# EAGLE design dd2007 (EAGLE 5.00)

## Sheet 1 of 2
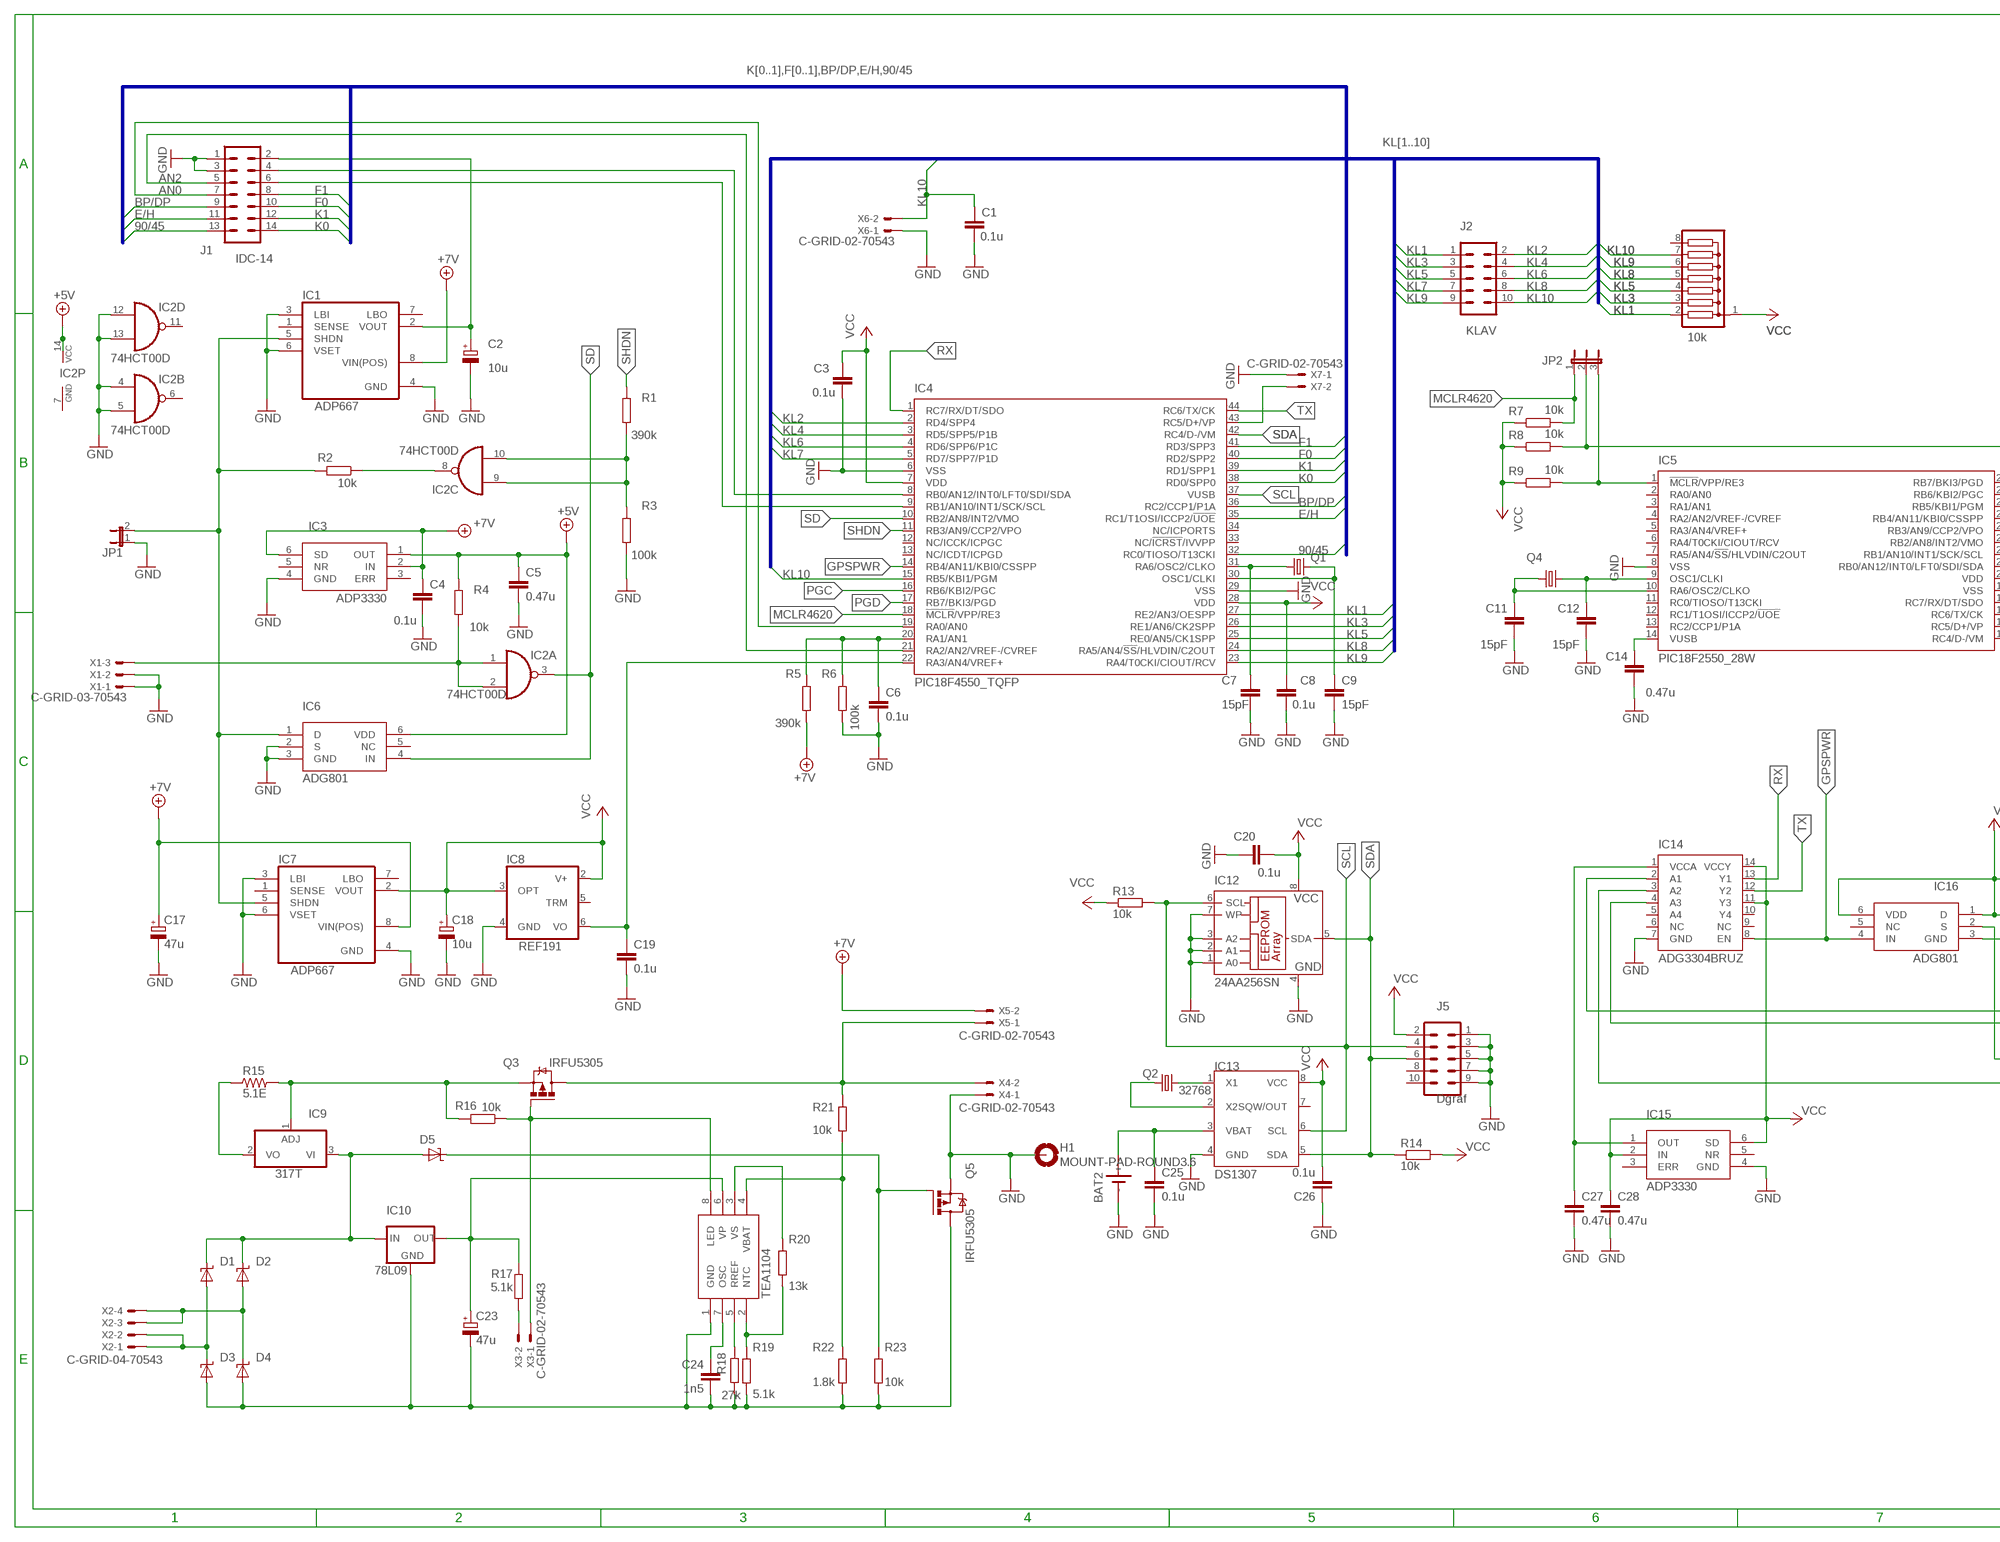
[diagram p0: schematic, sheet 1, part 1 of 2]
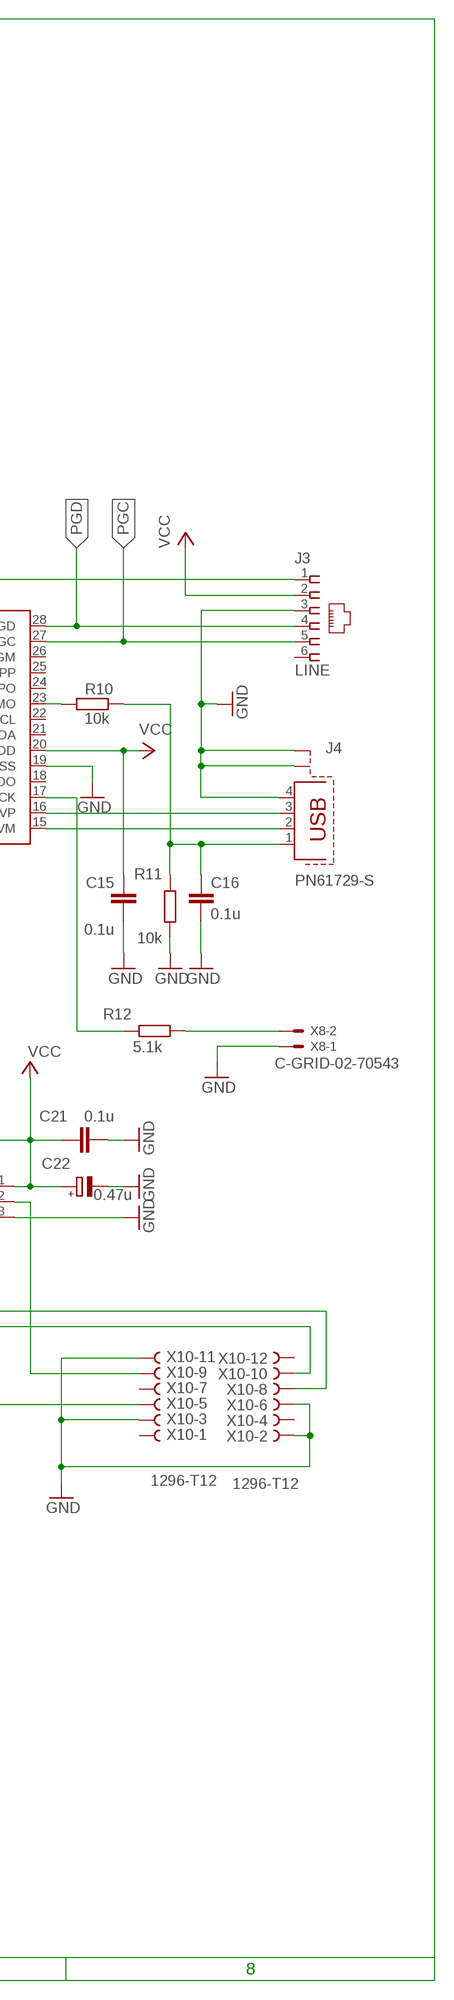
[diagram p1: schematic, sheet 1, part 2 of 2]

### Parts
BAT2  SN2032  [SN2032]
C1  0.1u  C-EUC1206  [C1206]
C2  10u  CPOL-EUCT3528  [CT3528]
C3  0.1u  C-EUC1206  [C1206]
C4  0.1u  C-EUC1206  [C1206]
C5  0.47u  C-EUC1206  [C1206]
C6  0.1u  C-EUC1206  [C1206]
C7  15pF  C-EUC1206  [C1206]
C8  0.1u  C-EUC1206  [C1206]
C9  15pF  C-EUC1206  [C1206]
C11  15pF  C-EUC1206  [C1206]
C12  15pF  C-EUC1206  [C1206]
C14  0.47u  C-EUC1206  [C1206]
C15  0.1u  C-EUC1206  [C1206]
C16  0.1u  C-EUC1206  [C1206]
C17  47u  CPOL-EUCT3528  [CT3528]
C18  10u  CPOL-EUCT3528  [CT3528]
C19  0.1u  C-EUC1206  [C1206]
C20  0.1u  C-EUC1206  [C1206]
C21  0.1u  C-EUC1206  [C1206]
C22  0.47u  CPOL-EUCT3528  [CT3528]
C23  47u  CPOL-EUCT3528  [CT3528]
C24  1n5  C-EUC1206  [C1206]
C25  0.1u  C-EUC1206  [C1206]
C26  0.1u  C-EUC1206  [C1206]
C27  0.47u  C-EUC1206  [C1206]
C28  0.47u  C-EUC1206  [C1206]
D1  SUPPRESSOR-SMBJ  [SMBJ]
D2  SUPPRESSOR-SMBJ  [SMBJ]
D3  SUPPRESSOR-SMBJ  [SMBJ]
D4  SUPPRESSOR-SMBJ  [SMBJ]
D5  SUPPRESSOR-SMBJ  [SMBJ]
H1  MOUNT-PAD-ROUND3.6  [3,6-PAD]
IC1  ADP667  MAX666CSA  [SO08]
IC2  74HCT00D  [SO14]
IC3  ADP3330  [SOT-23-6]
IC4  PIC18F4550_TQFP  [TQFP44]
IC5  PIC18F2550_28W  [SO28W]
IC6  ADG801  [SOT-23-6]
IC7  ADP667  MAX666CSA  [SO08]
IC8  REF191  REF01D  [SO08]
IC9  317T  [TO220H]
IC10  78L09  78LXX  [78LXX]
IC11  TEA1104  [SOIC-8]
IC12  24AA256SN  [SO-08]
IC13  DS1307  [SOIC-8]
IC14  ADG3304BRUZ  [TSSOP14]
IC15  ADP3330  [SOT-23-6]
IC16  ADG801  [SOT-23-6]
J1  IDC-14  ML14  [ML14]
J2  KLAV  ML10  [ML10]
J3  LINE  520258-3  [520258-3]
J4  PN61729-S  [PN61729-S]
J5  Dgraf  ML10  [ML10]
JP1  JP1E  [JP1]
JP2  JP2E  [JP2]
Q1  CRYSTALHC49S  [HC49/S]
Q2  32768  CRYSTALTC38H  [TC38H]
Q3  IRFU5305  [I-PAK_TO251AA]
Q4  CRYSTALHC49S  [HC49/S]
Q5  IRFU5305  [I-PAK_TO251AA]
R1  390k  R-EU_M1206  [M1206]
R2  10k  R-EU_M1206  [M1206]
R3  100k  R-EU_M1206  [M1206]
R4  10k  R-EU_M1206  [M1206]
R5  390k  R-EU_M1206  [M1206]
R6  100k  R-EU_M1206  [M1206]
R7  10k  R-EU_M1206  [M1206]
R8  10k  R-EU_M1206  [M1206]
R9  10k  R-EU_M1206  [M1206]
R10  10k  R-EU_M1206  [M1206]
R11  10k  R-EU_M1206  [M1206]
R12  5.1k  R-EU_M1206  [M1206]
R13  10k  R-EU_M1206  [M1206]
R14  10k  R-EU_M1206  [M1206]
R15  5.1E  R_X0207/10B  [0207/10B]
R16  10k  R-EU_M1206  [M1206]
R17  5.1k  R-EU_M1206  [M1206]
R18  27k  R-EU_M1206  [M1206]
R19  5.1k  R-EU_M1206  [M1206]
R20  13k  R-EU_M1206  [M1206]
R21  10k  R-EU_M1206  [M1206]
R22  1.8k  R-EU_M1206  [M1206]
R23  10k  R-EU_M1206  [M1206]
RN1  10k  G07R  [SIL8]
X1  C-GRID-03-70543  [70543-03]
X2  C-GRID-04-70543  [70543-04]
X3  C-GRID-02-70543  [70543-02]
X4  C-GRID-02-70543  [70543-02]
X5  C-GRID-02-70543  [70543-02]
X6  C-GRID-02-70543  [70543-02]
X7  C-GRID-02-70543  [70543-02]
X8  C-GRID-02-70543  [70543-02]
X10  1296-T12  [1296-12]

### Nets
90/45 [net12]: IC4.32(RC0/TIOSO/T13CKI) J1.13
+5V [net12]: C5.1 IC2.14(P:VCC) IC3.1(OUT) IC6.6(VDD) R4.2
+7V [power25]: C4.1 C17.+ IC1.8(VIN(POS)) IC3.2(IN) IC3.6(SD) IC7.8(VIN(POS)) R5.1 X5.2
AN0 [net12]: IC4.19(RA0/AN0) J1.7
AN2 [net12]: IC4.21(RA2/AN2/VREF-/CVREF) J1.5
BP/DP [net12]: IC4.36(RC2/CCP1/P1A) J1.9
E/H [net12]: IC4.35(RC1/T1OSI/ICCP2/!UOE) J1.11
F0 [net12]: IC4.40(RD2/SPP2) J1.10
F1 [net12]: IC4.41(RD3/SPP3) J1.8
GND [net12]: BAT2.P$2(-) C1.1 C2.- C3.1 C4.2 C5.2 C6.2 C7.2 C8.1 C9.2 C11.1 C12.1 C14.1 C15.1 C16.2 C17.- C18.- C19.2 C20.2 C21.2 C22.- C25.2 C26.1 C27.2 C28.2 H1.B3,6(MOUNT) IC1.3(LBI) IC1.4(GND) IC1.6(VSET) IC2.4(B:I0) IC2.5(B:I1) IC2.12(D:I0) IC2.13(D:I1) IC3.4(GND) IC4.6(VSS) IC4.29(VSS) IC5.8(VSS) IC5.19(VSS) IC6.2(S) IC6.3(GND) IC7.3(LBI) IC7.4(GND) IC7.6(VSET) IC8.4(GND) IC12.1(A0) IC12.2(A1) IC12.3(A2) IC12.4(GND) IC12.7(WP) IC13.4(GND) IC14.7(GND) IC15.4(GND) IC16.3(GND) J1.1 J1.3 J3.3 J4.4 J4.S1 J4.S2 J5.1 J5.3 J5.5 J5.7 J5.9 JP1.1 Q5.3(S) R3.1 R6.1 R11.1 X1.1 X1.2 X4.1 X6.1 X7.1 X8.1 X10.2 X10.3 X10.6 X10.11
GPSPWR [net12]: IC4.14(RB4/AN11/KBI0/CSSPP) IC14.8(EN) IC16.4(IN)
K0 [net12]: IC4.38(RD0/SPP0) J1.14
K1 [net12]: IC4.39(RD1/SPP1) J1.12
KL1 [net12]: IC4.27(RE2/AN3/OESPP) J2.1 RN1.2
KL2 [net12]: IC4.2(RD4/SPP4) J2.2
KL3 [net12]: IC4.26(RE1/AN6/CK2SPP) J2.3 RN1.3
KL4 [net12]: IC4.3(RD5/SPP5/P1B) J2.4
KL5 [net12]: IC4.25(RE0/AN5/CK1SPP) J2.5 RN1.4
KL6 [net12]: IC4.4(RD6/SPP6/P1C) J2.6
KL7 [net12]: IC4.5(RD7/SPP7/P1D) J2.7
KL8 [net12]: IC4.24(RA5/AN4/!SS!/HLVDIN/C2OUT) J2.8 RN1.5
KL9 [net12]: IC4.23(RA4/T0CKI/CIOUT/RCV) J2.9 RN1.6
KL10 [net12]: C1.2 IC4.15(RB5/KBI1/PGM) J2.10 RN1.7 X6.2
MCLR4620 [net12]: IC4.18(!MCLR!/VPP/RE3) JP2.1 R7.2
N$1 [power]: D2.A D4.C X2.3 X2.4
N$2 [power]: D1.A D3.C X2.1 X2.2
N$3 [power]: IC9.1(ADJ) Q3.3(S) R15.2 R16.2
N$4 [power]: IC9.2(VO) R15.1
N$5 [power]: D1.C D2.C D5.A IC9.3(VI) IC10.IN
N$6 [power]: C23.- C24.1 D3.A D4.A IC10.GND IC11.1(GND) Q5.2(D) R18.1 R19.2 R22.2 R23.2
N$7 [net16]: C23.+ IC10.OUT IC11.6(VP) R17.2
N$8 [net16]: R17.1 X3.2
N$9 [net12]: IC11.8(LED) Q3.1(G) R16.1 X3.1
N$10 [power25]: C2.+ IC1.2(VOUT) J1.2
N$11: IC2.8(C:O) R2.1
N$12 [net12]: IC1.5(SHDN) IC6.1(D) IC7.5(SHDN) JP1.2 R2.2
N$13 [net12]: C19.1 IC4.22(RA3/AN4/VREF+) IC8.6(VO)
N$14 [net12]: C7.1 IC4.31(RA6/OSC2/CLKO) Q1.1
N$15 [net12]: C24.2 IC11.7(OSC)
N$16 [net12]: IC11.5(RREF) R18.2
N$17 [net12]: IC13.1(X1) Q2.2
N$18 [net12]: IC13.2(X2) Q2.1
N$19: IC4.43(RC5/D+/VP) X7.2
N$20 [net12]: C9.1 IC4.30(OSC1/CLKI) Q1.2
N$21 [net12]: J3.1 JP2.2 R8.2
N$22 [net12]: IC11.2(NTC) R19.1 R20.2
N$23 [net12]: C12.2 IC5.9(OSC1/CLKI) Q4.2
N$24 [net12]: C11.2 IC5.10(RA6/OSC2/CLKO) Q4.1
N$25 [net12]: C14.2 IC5.14(VUSB)
N$26 [net12]: IC5.1(!MCLR!/VPP/RE3) JP2.3 R9.2
N$27 [net12]: D5.C Q5.1(G) R23.1
N$28 [net12]: IC2.1(A:I0) IC2.2(A:I1) R4.1 X1.3
N$30 [net12]: IC5.23(RB2/AN8/INT2/VMO) R10.1
N$31 [net12]: C16.1 J4.1 R10.2 R11.2
N$32 [net12]: IC5.15(RC4/D-/VM) J4.2
N$33 [net12]: IC5.16(RC5/D+/VP) J4.3
N$34 [net12]: IC5.17(RC6/TX/CK) R12.2
N$35 [net12]: R12.1 X8.2
N$37 [net12]: IC4.8(RB0/AN12/INT0/LFT0/SDI/SDA) J1.4
N$38 [net12]: C6.1 IC4.20(RA1/AN1) R5.2 R6.2
N$39 [net12]: IC4.9(RB1/AN10/INT1/SCK/SCL) J1.6
N$40 [net12]: IC11.3(VS) R20.1
N$41 [net12]: IC11.4(VBAT) R21.2 R22.1
N$42 [power]: Q3.2(D) R21.1 X4.2 X5.1
N$43 [net12]: IC2.9(C:I0) IC2.10(C:I1) R1.1 R3.2
N$44 [net12]: IC14.2(A1) X10.8
N$45 [net12]: IC16.2(S) X10.9
N$46 [net12]: IC14.3(A2) X10.5
N$47 [net12]: C27.1 IC14.1(VCCA) IC15.1(OUT)
N$48 [net12]: IC14.4(A3) X10.10
N$50 [net12]: BAT2.P$1(+) C25.1 IC13.3(VBAT)
PGC [net12]: IC4.16(RB6/KBI2/PGC) IC5.27(RB6/KBI2/PGC) J3.5
PGD [net12]: IC4.17(RB7/BKI3/PGD) IC5.28(RB7/BKI3/PGD) J3.4
RX [net12]: IC4.1(RC7/RX/DT/SDO) IC14.13(Y1)
SCL [net12]: IC4.37(VUSB) IC12.6(SCL) IC13.6(SCL) J5.4 R13.2
SD [net12]: IC2.3(A:O) IC4.10(RB2/AN8/INT2/VMO) IC6.4(IN)
SDA [net12]: IC4.42(RC4/D-/VM) IC12.5(SDA) IC13.5(SDA) J5.6 R14.1
SHDN [net12]: IC4.11(RB3/AN9/CCP2/VPO) R1.2
TX [net12]: IC4.44(RC6/TX/CK) IC14.12(Y2)
VCC [net12]: C3.2 C8.2 C15.2 C18.+ C20.1 C21.1 C22.+ C26.2 C28.1 IC4.7(VDD) IC4.28(VDD) IC5.20(VDD) IC7.2(VOUT) IC8.2(V+) IC8.3(OPT) IC12.8(VCC) IC13.8(VCC) IC14.11(Y3) IC14.14(VCCY) IC15.2(IN) IC15.6(SD) IC16.1(D) IC16.6(VDD) J3.2 J5.2 R7.1 R8.1 R9.1 R13.1 R14.2 RN1.1
Unconnected: IC1.1(SENSE) IC1.7(LBO) IC2.6(B:O) IC2.11(D:O) IC3.3(ERR) IC3.5(NR) IC4.12(NC/ICCK/ICPGC) IC4.13(NC/ICDT/ICPGD) IC4.33(NC/!ICRST!/IVVPP) IC4.34(NC/ICPORTS) IC5.2(RA0/AN0) IC5.3(RA1/AN1) IC5.4(RA2/AN2/VREF-/CVREF) IC5.5(RA3/AN4/VREF+) IC5.6(RA4/T0CKI/CIOUT/RCV) IC5.7(RA5/AN4/!SS!/HLVDIN/C2OUT) IC5.11(RC0/TIOSO/T13CKI) IC5.12(RC1/T1OSI/ICCP2/!UOE) IC5.13(RC2/CCP1/P1A) IC5.18(RC7/RX/DT/SDO) IC5.21(RB0/AN12/INT0/LFT0/SDI/SDA) IC5.22(RB1/AN10/INT1/SCK/SCL) IC5.24(RB3/AN9/CCP2/VPO) IC5.25(RB4/AN11/KBI0/CSSPP) IC5.26(RB5/KBI1/PGM) IC6.5(NC) IC7.1(SENSE) IC7.7(LBO) IC8.5(TRM) IC13.7(SQW/OUT) IC14.5(A4) IC14.6(NC) IC14.9(NC) IC14.10(Y4) IC15.3(ERR) IC15.5(NR) IC16.5(NC) J3.6 J5.8 J5.10 RN1.8 X10.1 X10.4 X10.7 X10.12

### Buses
KL[1..10]
K[0..1],F[0..1],BP/DP,E/H,90/45

## Sheet 2 of 2

## Power pins joined to a net without a drawn wire
GND: IC2.7(P:GND)

## Library data of the parts
BAT2 = sn2032:SN2032: LI BATTERY dip07
C1 C3-C9 C11 C12 C14-C16 C19-C21 C24-C28 = rcl:C-EU: CAPACITOR, European symbol
C2 C17 C18 C22 C23 = rcl:CPOL-EU: POLARIZED CAPACITOR, European symbol
D1-D5 = diode:SUPPRESSOR-: Suppressor diode
H1 = holes:MOUNT-PAD-ROUND: MOUNTING PAD, round
IC1 IC7 = maxim:MAX666CSA: Positive VOLTAGE REGULATOR
IC2 = 74xx-eu:74*00: Quad 2-input NAND gate
IC3 IC15 = raznoe01:ADP3330: adp3330
IC4 = microchip:PIC18F4*_TQFP: USB Microcontrollers with nanoWatt Technology High-Performance, Enhanced Flash, 28/40/44-Pin, Source: http://ww1.microchip.com/downloads/en/devicedoc/39632c.pdf
IC5 = microchip:PIC18F2*_28: USB Microcontrollers with nanoWatt Technology High-Performance, Enhanced Flash, 28/40/44-Pin, Source: http://ww1.microchip.com/downloads/en/devicedoc/39632c.pdf
IC6 IC16 = raznoe01:ADG801: adg801 adg 801 adg-801
IC8 = linear:REF01: VOLTAGE REFERENCE
IC9 = linear:*317: Positive VOLTAGE REGULATOR
IC10 = v-reg:78LXX: VOLTAGE REGULATOR
IC11 = raznoe01:TEA1104: tea1104
IC12 = microchip:24*: Serial EEPROM I2C
IC13 = dallas-1:DS1307: I2C Serial RTC w/56 bytes battery backed RAM
IC14 = ad74111_adg3304:ADG3304B?Z: Low Voltage, 1.15 V to 5.5 V, 4-Channel, Bidirectional Logic Level Translator Source: http://www.analog.com/UploadedFiles/Data_Sheets/642205373ADG3304_b.pdf
J1 = con-harting-ml:ML14: HARTING
J2 J5 = con-harting-ml:ML10: HARTING
J3 = con-amp:520258-3: AMP connector
J4 = con-berg:PN61729-S: BERG USB connector
JP1 = jumper:JP1E: JUMPER
JP2 = jumper:JP2E: JUMPER
Q1 Q2 Q4 = crystal:CRYSTAL: CRYSTAL
Q3 Q5 = transistor-power:IRF?5305: HEXFET Power MOSFET Source: http://www.irf.com/product-info/datasheets/data/irfr5305pbf.pdf
R1-R14 R16-R23 = rcl:R-EU_: RESISTOR, European symbol
R15 = rc-master:R_: RESISTOR
RN1 = resistor-sil:G07R: SIL RESISTOR
X1 = con-molex:C-GRID-03: CONNECTOR wire to board 2.54 mm (0.100") pitch header
X2 = con-molex:C-GRID-04: CONNECTOR wire to board 2.54 mm (0.100") pitch header
X3-X8 = con-molex:C-GRID-02: CONNECTOR wire to board 2.54 mm (0.100") pitch header
X10 = con-leotronics:1296-T12: 1.27mm SINGLE ROW FEMALE SOCKET Source: http://www.leotronics.co.uk/Conexcon/Data%20Sheets/sec.%20A/1296ing.pdf

## Net classes
1 power: width 0.813 mm
2 net12: width 0.305 mm
3 power25: width 0.635 mm
4 power24: width 0.61 mm
5 net16: width 0.406 mm

## Board
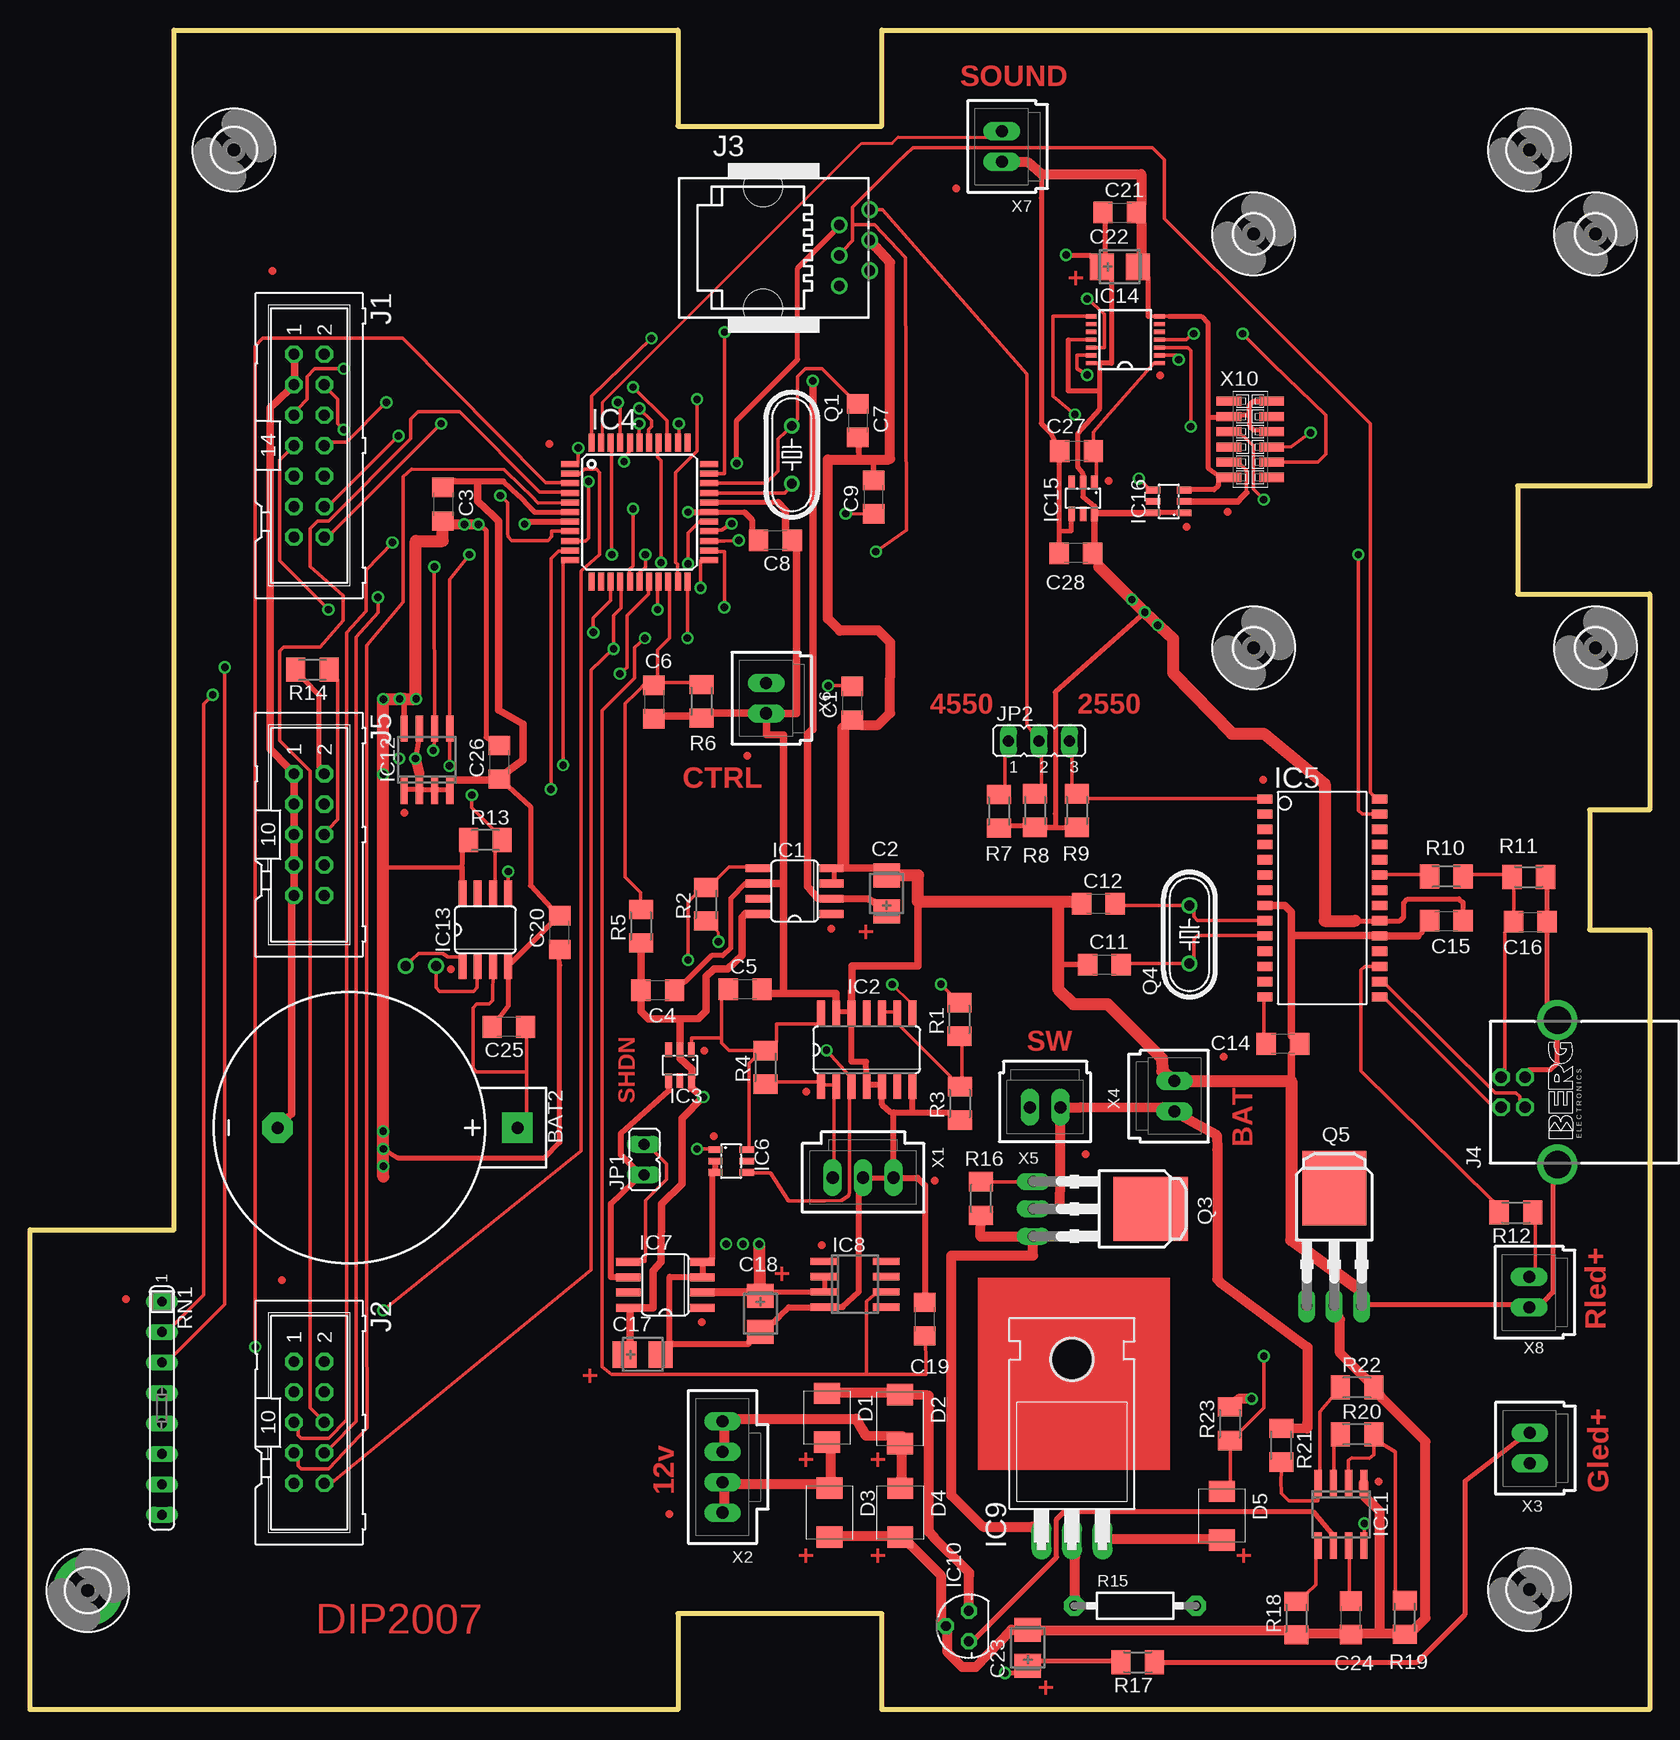
[diagram p2: board, top side]
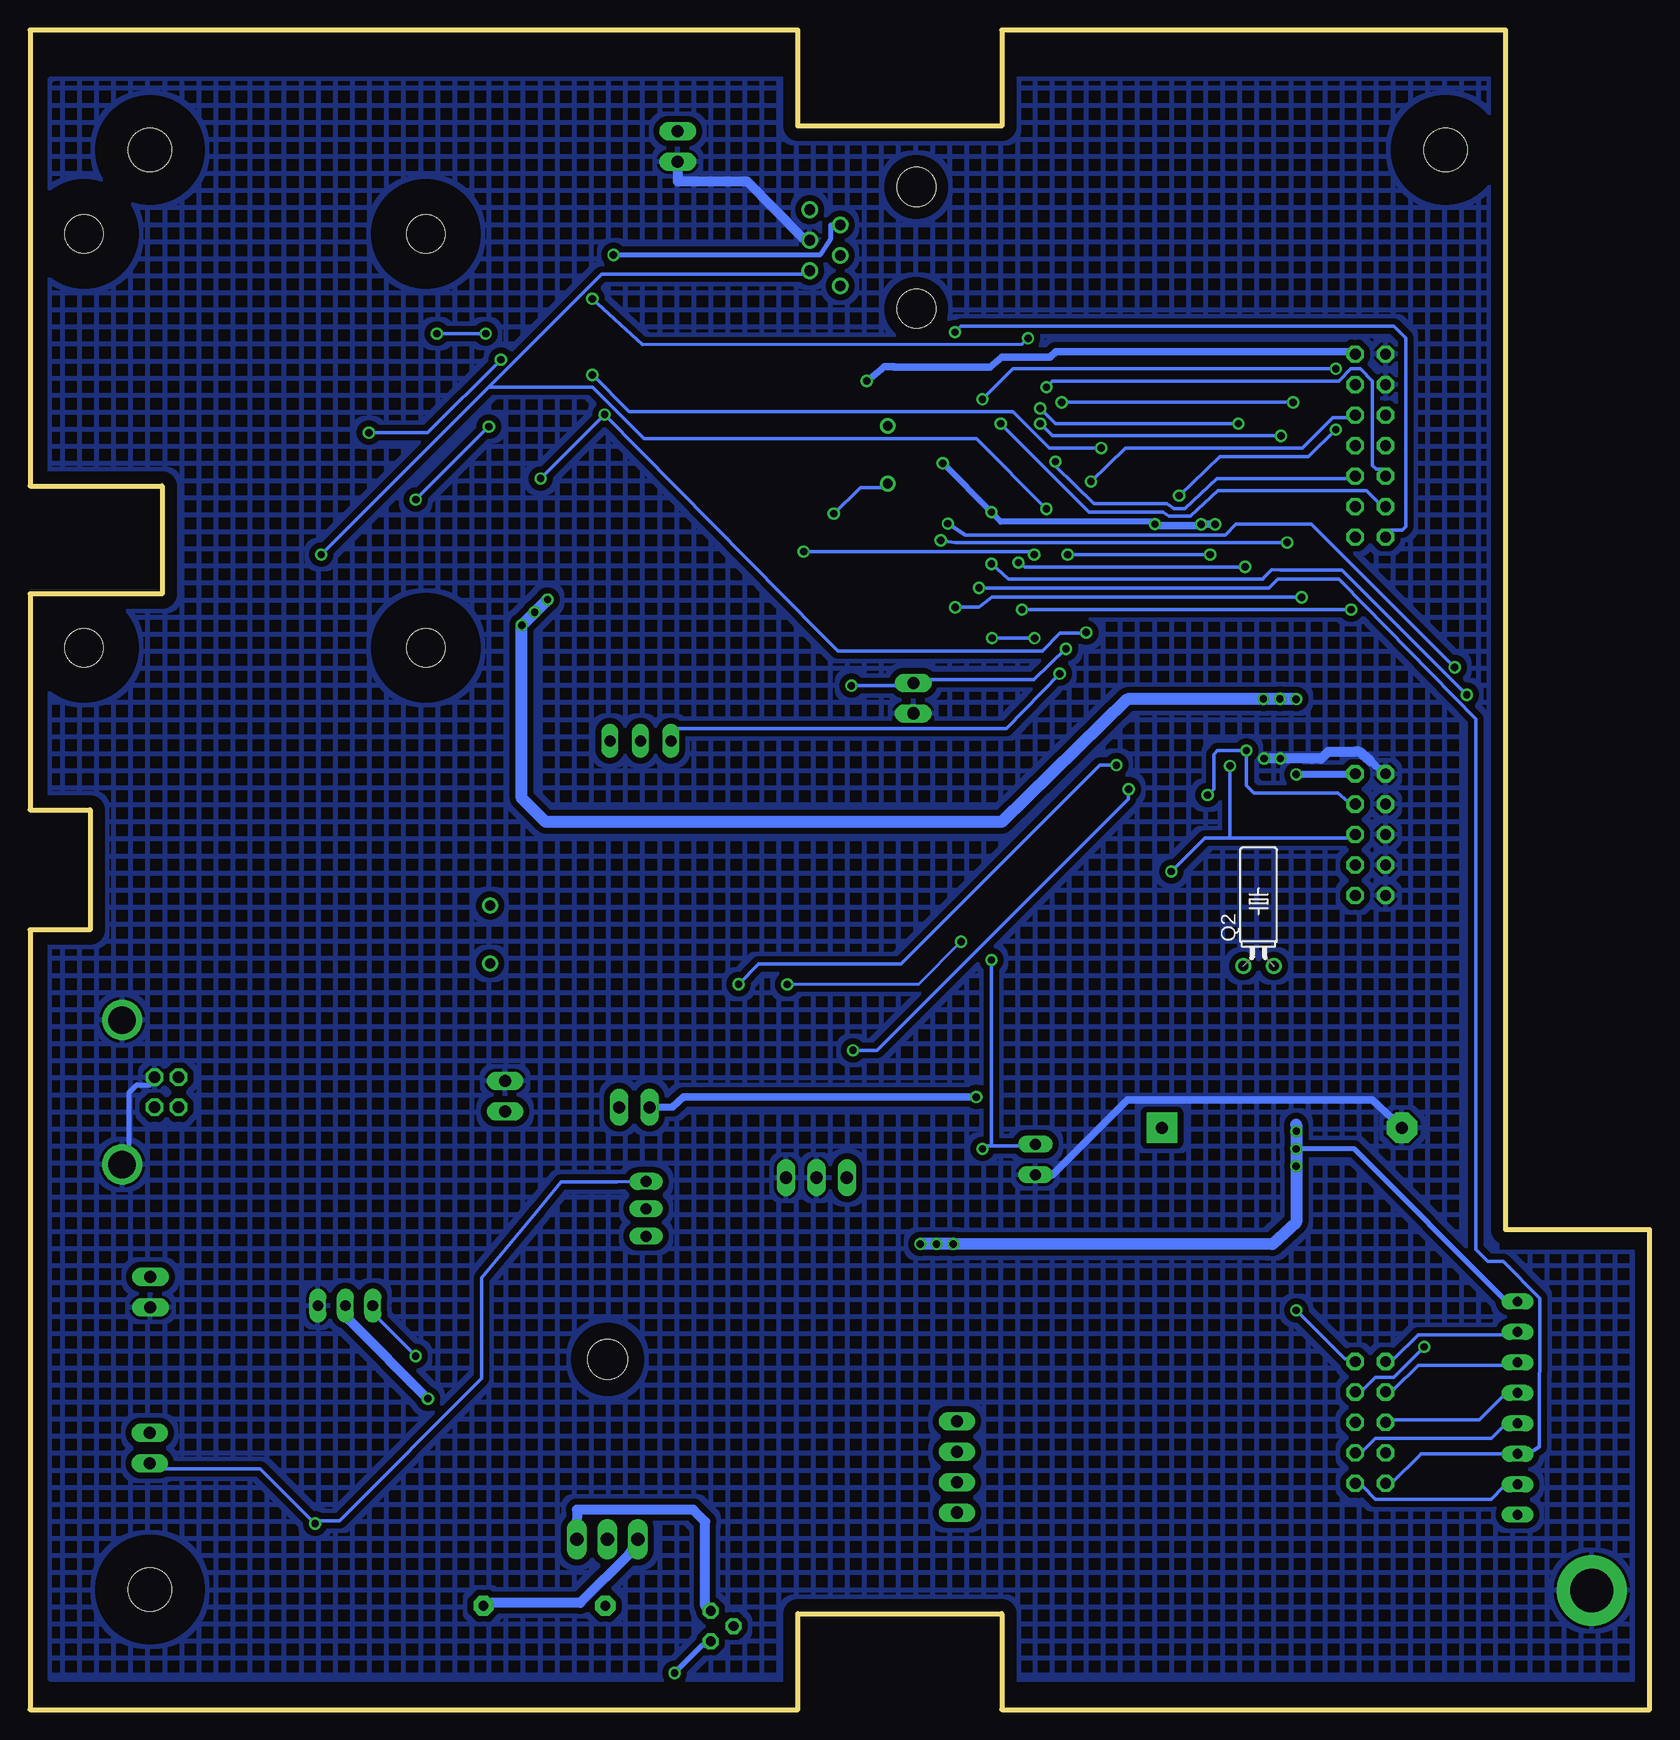
[diagram p3: board, bottom side, seen from below]

Size 135 x 140 mm. Coordinates in mm from the lower left corner, seen from the top.
Outline: 0,0 0,40 12,40 12,140 54,140 54,132 71,132 71,140 135,140 135,102 124,102 124,93 135,93 135,75 130,75 130,65 135,65 135,0 71,0 71,8 54,8 54,0 0,0
Copper layers (1*16): Top 0.035mm / dielectric 1.5mm / Bottom 0.035mm
Design rules "default *": minimum track width 10mil, minimum drill 24mil, track to track 8mil, track to pad 8mil, pad to pad 8mil, via to via 8mil, smd to smd 8mil, copper to edge 40mil, drill to drill 8mil, minimum pad ring 10mil, minimum via ring 8mil, stop-mask expansion 4mil, vias tented up to drill 0mil, thermal gap 10mil

### Footprints (pad centres in the part's own frame; a part is rotated, then mirrored left to right if it is on the bottom)
SN2032 = drill 1 pad 2.54 square: P$1 0,14 | drill 1 pad 2.54 octagon: P$2 0,-6
C1206 = smd 1.6 x 1.8: 1 -1.4,0; 2 1.4,0
CT3528 = smd 2 x 2.2: + -1.5,0; - 1.5,0
SMBJ = smd 1.78 x 2.16: A 2.04,0; C -2.03,0
3,6-PAD = drill 3.6 pad 5.842 round: B3,6 0,0
SO08 = smd 0.66 x 2.032: 1 -1.905,-3.073; 2 -0.635,-3.073; 3 0.635,-3.073; 4 1.905,-3.073; 5 1.905,3.073; 6 0.635,3.073; 7 -0.635,3.073; 8 -1.905,3.073
SO14 = smd 0.66 x 2.032: 1 -3.81,-3.073; 2 -2.54,-3.073; 3 -1.27,-3.073; 4 0,-3.073; 5 1.27,-3.073; 6 2.54,-3.073; 7 3.81,-3.073; 8 3.81,3.073; 9 2.54,3.073; 10 1.27,3.073; 11 0,3.073; 12 -1.27,3.073; 13 -2.54,3.073; 14 -3.81,3.073
SOT-23-6 = smd 0.55 x 1.2: 1 -0.95,-1.3; 2 0,-1.3; 3 0.95,-1.3; 4 0.95,1.3; 5 0,1.3; 6 -0.95,1.3
TQFP44 = smd 1.5 x 0.5: 1 -5.8,4; 2 -5.8,3.2; 3 -5.8,2.4; 4 -5.8,1.6; 5 -5.8,0.8; 6 -5.8,0; 7 -5.8,-0.8; 8 -5.8,-1.6; 9 -5.8,-2.4; 10 -5.8,-3.2; 11 -5.8,-4; 23 5.8,-4; 24 5.8,-3.2; 25 5.8,-2.4; 26 5.8,-1.6; 27 5.8,-0.8; 28 5.8,0; 29 5.8,0.8; 30 5.8,1.6; 31 5.8,2.4; 32 5.8,3.2; 33 5.8,4 | smd 0.5 x 1.5: 12 -4,-5.8; 13 -3.2,-5.8; 14 -2.4,-5.8; 15 -1.6,-5.8; 16 -0.8,-5.8; 17 0,-5.8; 18 0.8,-5.8; 19 1.6,-5.8; 20 2.4,-5.8; 21 3.2,-5.8; 22 4,-5.8; 34 4,5.8; 35 3.2,5.8; 36 2.4,5.8; 37 1.6,5.8; 38 0.8,5.8; 39 0,5.8; 40 -0.8,5.8; 41 -1.6,5.8; 42 -2.4,5.8; 43 -3.2,5.8; 44 -4,5.8
SO28W = smd 0.762 x 1.27: 1 -7.62,-4.78; 2 -6.35,-4.78; 3 -5.08,-4.78; 4 -3.81,-4.78; 5 -2.54,-4.78; 6 -1.27,-4.78; 7 0,-4.78; 8 1.27,-4.78; 9 2.54,-4.78; 10 3.81,-4.78; 11 5.08,-4.78; 12 6.35,-4.78; 13 7.62,-4.78; 14 8.89,-4.78; 15 8.89,4.78; 16 7.62,4.78; 17 6.35,4.78; 18 5.08,4.78; 19 3.81,4.78; 20 2.54,4.78; 21 1.27,4.78; 22 0,4.78; 23 -1.27,4.78; 24 -2.54,4.78; 25 -3.81,4.78; 26 -5.08,4.78; 27 -6.35,4.78; 28 -7.62,4.78
SO08' = smd 0.6 x 2.2: 1 -1.905,-2.6; 2 -0.635,-2.6; 3 0.635,-2.6; 4 1.905,-2.6; 5 1.905,2.6; 6 0.635,2.6; 7 -0.635,2.6; 8 -1.905,2.6
TO220H = drill 1.118 long: 1 -2.54,-10.16; 2 0,-10.16; 3 2.54,-10.16 | hole 3.302: 0,4.826
78LXX = drill 0.813 octagon: GND 0,1.905; IN 1.27,0; OUT -1.27,0
SOIC-8 = smd 0.6 x 2.2: 1 -1.905,-2.6; 2 -0.635,-2.6; 3 0.635,-2.6; 4 1.905,-2.6; 5 1.905,2.6; 6 0.635,2.6; 7 -0.635,2.6; 8 -1.905,2.6
SO-08 = smd 0.6 x 2.2: 1 -1.905,-2.6; 2 -0.635,-2.6; 3 0.635,-2.6; 4 1.905,-2.6; 5 1.905,2.6; 6 0.635,2.6; 7 -0.635,2.6; 8 -1.905,2.6
SOIC-8' = smd 2.032 x 0.66: 1 -3.073,1.27; 2 -3.073,0; 3 -3.073,-1.27; 4 -3.073,-2.54; 5 3.073,-2.54; 6 3.073,-1.27; 7 3.073,0; 8 3.073,1.27
TSSOP14 = smd 0.9 x 0.35: 1 -2.875,1.95; 2 -2.875,1.3; 3 -2.875,0.65; 4 -2.875,0; 5 -2.875,-0.65; 6 -2.875,-1.3; 7 -2.875,-1.95; 8 2.825,-1.95; 9 2.825,-1.3; 10 2.825,-0.65; 11 2.825,0; 12 2.825,0.65; 13 2.825,1.3; 14 2.825,1.95
ML14 = drill 0.914 octagon: 1 -7.62,-1.27; 2 -7.62,1.27; 3 -5.08,-1.27; 4 -5.08,1.27; 5 -2.54,-1.27; 6 -2.54,1.27; 7 0,-1.27; 8 0,1.27; 9 2.54,-1.27; 10 2.54,1.27; 11 5.08,-1.27; 12 5.08,1.27; 13 7.62,-1.27; 14 7.62,1.27
ML10 = drill 0.914 octagon: 1 -5.08,-1.27; 2 -5.08,1.27; 3 -2.54,-1.27; 4 -2.54,1.27; 5 0,-1.27; 6 0,1.27; 7 2.54,-1.27; 8 2.54,1.27; 9 5.08,-1.27; 10 5.08,1.27
520258-3 = drill 0.889 round: 1 -3.175,8.001; 2 -1.905,5.461; 3 -0.635,8.001; 4 0.635,5.461; 5 1.905,8.001; 6 3.175,5.461 | hole 3.251: -5.08,-0.889; 5.08,-0.889
PN61729-S = drill 0.95 octagon: 1 1.25,4.71; 2 -1.25,4.71; 3 -1.25,2.71; 4 1.25,2.71 | drill 2.3 pad 2.9 round: S1 -6.02,0; S2 6.02,0
JP1 = drill 0.914 long: 1 0,-1.27; 2 0,1.27
JP2 = drill 0.914 long: 1 -2.54,0; 2 0,0; 3 2.54,0
HC49/S = drill 0.813 round: 1 -2.413,0; 2 2.413,0
TC38H = drill 0.813 round: 1 -1.27,0; 2 1.27,0
I-PAK_TO251AA = drill 0.889 long: 1 -2.286,-5.334; 2 0,-5.334; 3 2.286,-5.334 | smd 5.334 x 6.223: 4 0,4.445
M1206 = smd 1.6 x 2: 1 -1.4,0; 2 1.4,0
0207/10B = drill 0.813 pad 1.676 octagon: 1 -5.08,0; 2 5.08,0
SIL8 = drill 0.813 long: 1 -8.89,0; 2 -6.35,0; 3 -3.81,0; 4 -1.27,0; 5 1.27,0; 6 3.81,0; 7 6.35,0; 8 8.89,0
3,6 = hole 3.6: 0,0
3,2 = hole 3.2: 0,0
70543-03 = drill 1.016 long: 1 -2.54,0; 2 0,0; 3 2.54,0
70543-04 = drill 1.016 long: 1 -3.81,0; 2 -1.27,0; 3 1.27,0; 4 3.81,0
70543-02 = drill 1.016 long: 1 -1.27,0; 2 1.27,0
1296-12 = smd 0.76 x 2.05: 1 -3.175,-1.78; 2 -3.175,1.78; 3 -1.905,-1.78; 4 -1.905,1.78; 5 -0.635,-1.78; 6 -0.635,1.78; 7 0.635,-1.78; 8 0.635,1.78; 9 1.905,-1.78; 10 1.905,1.78; 11 3.175,-1.78; 12 3.175,1.78

### Placement (x,y rotation side)
BAT2  26.63,48.5 270 top
C1  68.55,83.89 90 top
C2  71.4,68.02 90 top
C3  34.42,100.47 270 top
C4  52.32,59.97 0 top
C5  59.61,60.05 0 top
C6  52.01,83.98 270 top
C7  69,107.44 270 top
C8  62.14,97.46 180 top
C9  70.33,101.06 90 top
C11  89.56,62.1 0 top
C12  89.06,67.18 0 top
C14  104.44,55.48 180 top
C15  118.06,65.74 0 top
C16  125.06,65.66 0 top
C17  51.08,29.6 0 top
C18  60.89,32.99 270 top
C19  74.6,32.54 90 top
C20  44.15,64.76 90 top
C21  90.84,124.78 0 top
C22  90.84,120.26 0 top
C23  83.17,5.15 90 top
C24  110.1,7.65 90 top
C25  39.91,56.9 180 top
C26  39.13,78.96 90 top
C27  87.24,104.9 180 top
C28  87.19,96.38 180 top
D1  66.44,24.33 270 top
D2  72.52,24.22 270 top
D3  66.64,16.42 270 top
D4  72.54,16.41 270 top
D5  99.35,16.16 270 top
H1  4.81,9.92 0 top
IC1  63.74,68.22 90 top
IC2  69.75,55 0 top
IC3  54.18,53.71 180 top
IC4  50.8,99.81 0 top
IC5  107.72,68.29 270 top
IC6  58.45,45.72 270 top
IC7  52.96,35.4 90 top
IC8  REF191  [SO08']  68.77,35.45 270 top
IC9  86.86,24.35 0 top
IC10  78.26,6.95 90 top
IC11  109.28,16.27 180 top
IC12  33.09,79.17 0 top
IC13  DS1307  [SOIC-8']  37.32,65 90 top
IC14  91.28,114.18 180 top
IC15  87.78,100.97 180 top
IC16  94.92,100.7 90 top
J1  23.27,105.36 270 top
J2  23.27,23.92 270 top
J3  62,121.84 270 top
J4  127.32,51.45 90 top
J5  23.27,72.92 270 top
JP1  51.19,45.84 0 top
JP2  84.12,80.74 0 top
Q1  63.5,104.59 270 top
Q2  32.59,61.97 0 bottom
Q3  88.98,41.73 270 top
Q4  96.65,64.6 90 top
Q5  108.72,39 0 top
R1  77.46,57.52 90 top
R2  56.35,67.12 90 top
R3  77.51,50.52 90 top
R4  61.31,53.52 90 top
R5  50.93,65.3 90 top
R6  55.98,84.04 90 top
R7  80.77,74.88 90 top
R8  83.78,74.94 90 top
R9  87.27,74.94 90 top
R10  118.06,69.44 0 top
R11  124.94,69.41 180 top
R12  123.86,41.42 180 top
R13  37.96,72.47 0 top
R14  23.54,86.68 180 top
R15  92.12,8.65 0 top
R16  79.28,42.6 270 top
R17  92.34,3.95 180 top
R18  105.56,7.62 90 top
R19  114.59,7.68 270 top
R20  110.62,22.94 0 top
R21  104.3,22.03 270 top
R22  110.62,26.84 0 top
R23  100.01,23.82 90 top
RN1  10.99,25.12 270 top
U$3  [3,6]  17,130 0 top
U$4  [3,6]  125,130 0 top
U$5  [3,6]  125,10 0 top
U$8  [3,2]  102,123 0 top
U$10  [3,2]  130.5,123 0 top
U$11  [3,2]  102,88.5 0 top
U$12  [3,2]  130.5,88.5 0 top
X1  69.45,44.33 180 top
X2  57.73,20.22 90 top
X3  125.02,21.78 90 top
X4  95.39,51.12 270 top
X5  84.62,50.2 180 top
X6  61.37,84.31 90 top
X7  81.01,130.29 90 top
X8  124.97,34.78 90 top
X10  101.72,105.88 270 top

### Tracks (layer width: path | path; a pad name or v marks a point on that pad's centre or on a via)
90/45  (via drill 0.61)
  Top 0.305: v57.9,114.81 57.9,103.02 57.13,103.02 IC4.32
  Bottom 0.305: v57.9,114.81 57.39,115.32 21.3,115.32 20.3,114.32 20.3,98.61 20.62,98.3 21.57,98.3 J1.13
+5V
  Top 0.305: 57.63,55.97 55.16,55.97 IC3.1 | 57.63,55.97 57.64,59.18 C5.1 | IC6.6 59.93,46.74 59.93,53.85 60.44,54.36 R4.2 | IC2.14 65.77,57.15 62.21,57.15 62.21,55.63 R4.2 | R4.2 58.27,54.92 57.63,55.55 57.63,55.97
+7V  (via drill 0.61)
  Top 0.635: C17.+ 50.02,30.48 50.02,33.27 IC7.8 50.78,33.48 51.93,33.48 51.93,36.58 52.6,37.3 52.65,42.16 54.34,43.83 54.34,49.28 v56.12,51.05 55.16,51.82 IC3.6 55.2,52.83 55.2,53.34 54.19,54.26 54.19,54.61 IC3.2 54.19,55.37 54.19,56.59 54.2,57.57 | 54.2,57.57 51.57,57.58 50.94,58.21 C4.1 R5.1 | IC1.8 59.64,66.34 59.34,66.03 59.34,62.84 58.15,61.72 57.01,61.72 56.37,61.09 56.37,58.22 55.74,57.59 54.2,57.57
  Bottom 0.635: v56.12,51.05 80.5,51.05 81.44,50.22 X5.2
AN0  (via drill 0.61)
  Top 0.305: v52.32,91.69 52.32,93.47 IC4.19 | v24.88,91.69 20.81,95.76 20.81,104.14 21.57,104.9 J1.7
  Bottom 0.305: v24.88,91.69 v52.32,91.69
AN2  (via drill 0.61)
  Top 0.305: v55.61,109.22 55.61,104.9 53.83,103.12 53.83,95.62 53.98,95.47 53.98,94.74 IC4.21 | v26.15,111.76 23.73,111.76 23.1,111.12 23.1,109.22 22.34,108.46 J1.5
  Bottom 0.305: v55.61,109.22 53.07,111.76 v26.15,111.76
BP/DP  (via drill 0.61)
  Top 0.305: v50.28,110.24 53.12,107.44 53.12,106.17 IC4.36
  Bottom 0.305: v50.28,110.24 49.77,110.74 25.89,110.74 24.88,111.76 24.11,111.76 23.1,110.74 23.1,103.69 22.78,103.38 22.34,103.38 J1.9
E/H  (via drill 0.61)
  Top 0.305: v54.09,107.19 54.09,106.17 IC4.35
  Bottom 0.305: v54.09,107.19 46.72,99.82 40.55,99.82 40.07,99.46 38.29,99.46 35.98,101.6 23.61,101.6 22.59,100.58 J1.11
F0  (via drill 0.61)
  Top 0.305: v49.51,104.02 49.51,104.39 50.02,104.9 IC4.40
  Bottom 0.305: v49.51,104.02 49.51,103.66 49.48,103.62 46.33,100.53 40.22,100.53 39.64,100.09 38.73,100.09 36.06,102.62 25.13,102.62 J1.10
F1  (via drill 0.61)
  Top 0.305: v49.01,108.97 49.21,108.47 IC4.41 | v29.7,108.97 26.4,105.66 25.13,105.66 J1.8
  Bottom 0.305: v29.7,108.97 v49.01,108.97
GND  (via drill 0.61)
  Top 0.305: 93.2,116.14 93.7,116.13 IC14.7 94.97,116.14
  Top 0.406: C25.2 39.1,57.66 39.86,58.67 39.86,60.96 IC13.4 40.12,62.23 43.42,65.53 C20.2 43.42,66.8 41.73,68.67 41.73,75.27 39.86,76.96 C26.1 | 39.45,102.39 40.72,101.17 41.74,100.15 42.07,99.81 44.43,99.81 IC4.6 | 35.08,102.39 C3.1 34.77,102.05 34.9,102.46 37.3,102.33 | 38.34,77.47 C26.1 | 34.99,77.47 IC12.4 34.78,76.71 34.02,76.71 IC12.3 33.51,76.71 32.75,76.71 IC12.2 | IC12.1 31.48,76.71 32.24,76.71 IC12.2 | 32.15,79.23 32.46,80.77 IC12.7 | 32.45,78.03 IC12.2 | C26.1 39.86,78.23 | 21.52,49.38 21.8,49.66 | 93.2,116.14 93.2,119.38 C22.- 92.64,121.11 | 92.64,123.95 C21.2 92.63,125.43 | IC16.3 96.72,101.66 96.81,101.68 98.72,101.68 99.04,101.99 99.04,102.11 99.04,102.7 X10.11 99.04,102.87 98.2,103.5 98.2,107.75 | 101.66,107.95 101.66,106.99 101.97,106.67 102.6,106.68 X10.6 | 101.66,107.95 100.82,107.95 X10.3 99.04,107.75 98.2,107.75 | 101.66,107.95 101.66,108.75 101.97,109.06 102.5,109.06 X10.2 | 94.97,116.14 97.63,116.14 98.2,115.55 98.2,107.75 | IC15.4 86.8,99.51 86.79,98.26 85.79,98.23 C28.2 85.79,96.98 85.79,104.9 C27.2 85.07,106.43 84.31,107.19 84.31,125.98 84.3,128 | 71.7,104.23 69.1,104.2 69.1,106.04 C7.2 69.07,105.41 69.1,104.05 69.1,104.22 70.32,104.27 C9.2 70.31,104.2 66.5,104.2 | R11.1 126.48,68.58 126.48,66.55 C16.2 126.48,64.77 126.48,58.93 J4.S2 127.33,53.91 126.73,53.34 124.95,53.34 J4.4 | J4.S1 126.98,43.94 126.98,34.8 126.22,34.04 X8.1 123.68,33.78 111.49,33.78 Q5.3 110.73,35.05 | 57.13,44.96 IC6.3 56.88,44.7 | 57.13,45.47 IC6.2 | 56.88,37.59 IC7.4 56.12,37.08 | 56.12,36.32 IC7.3 55.1,36.07 | 59.93,30.48 59.93,30.73 C18.- 61.96,32.26 | 65.26,33.52 IC8.4
  Top 0.406: C17.- 53.32,30.48 | 53.24,51.57 IC3.4 | 50.28,45.21 JP1.1 50.28,43.94 | 49.01,36.05 IC7.6 | X1.1 71.38,44.33 70.11,44.33 X1.2 69.09,44.03 | 85.7,67.34 87.35,67.35 87.35,67.18 C12.1 87.11,67.36 | 85.7,62.09 C11.1 85.7,62.09 | 115.69,64.48 116.06,64.77 116.06,65.02 C15.1 | 103.14,67 IC5.8 | 105.14,56.13 C14.1 105.14,54.61 | 112,64.52 IC5.19 | 62.34,100.61 57.13,100.61 IC4.29 | 52.82,82.8 C6.2 | 55.1,82.8 R6.1 56.88,83.06 | 63.9,96.82 C8.1 | 67.8,81.79 C1.1 69.33,82.06 | IC1.4 67.8,70.12 67.8,70.4 67.8,70.46 | IC1.3 67.04,69.09 67.04,69.85 IC1.4 | C2.- 70.86,70.13 | 67.8,70.13 IC1.4 | C4.2 54.59,60.66 56.83,62.85 57.77,62.85 58.4,63.46 58.4,67.62 59.65,68.89 IC1.6 61.5,68.86 | 76.69,49.78 R3.1 | 73.57,51.05 IC2.7 | 69.83,52.07 IC2.4 | IC2.5 70.85,52.07 | 61.71,59.69 C5.2 | IC2.13 67.29,58.17 68.31,58.17 IC2.12 68.49,57.35 | 72,49.78 71.74,49.78 | 71.08,50.37 71.03,50.4
  Top 0.5: 35.08,102.39 39.45,102.39 | 57.13,44.96 57.13,45.47 | 56.88,37.59 56.88,44.7 | 56.12,36.32 56.12,37.08 | 59.93,30.48 53.58,30.48 C17.- | 65.26,33.52 63.27,33.52 62.47,32.77 61.96,32.26 | 55.1,36.07 53.32,36.07 53.32,30.48 | 53.24,51.57 49.26,48.01 49.26,46.23 50.28,45.21 | 49.01,36.05 48.4,36.05 48.4,42.16 50.28,43.94 | C19.2 74.62,35.56 74.62,40.61 74.62,42.89 74.61,43.7 73.98,44.33 X1.1 72,44.73 72,49.78 73.57,49.78 | IC8.4 67.74,33.55 69.09,34.82 69.09,44.03 | 73.57,49.78 76.69,49.78 | 73.57,49.78 73.57,51.05 | 70.85,52.07 69.83,52.07 | 68.49,57.35 68.49,54 69.7,54 IC2.4 | 71.74,49.78 71.08,50.37 | 71.03,50.4 IC2.5
  Top 0.61: 34.99,77.47 38.34,77.47 | 37.3,102.33 37.3,100.74 38.01,100.08 38.54,99.58 39.05,99.07 39.05,83.3 41.12,82.13 41.12,79.14 39.86,78.23 | J1.1 22.08,112.52 22.08,111 J1.3 21.57,109.98 20,108.51 20,80.06 21.57,78.49 J5.1 22.01,77.44 22.01,75.92 J5.3 22.01,74.93 22.01,73.41 J5.5 22.01,72.39 22.01,70.87 J5.7 22.01,69.85 22.01,68.33 J5.9 21.8,67.31 21.8,49.66 | BAT2.P$2 21.52,49.38 | v32.13,79.27 32.15,79.23 | IC5.19 115.69,64.48 | 105.14,56.13 105.14,64.52 | 105.14,64.52 105.14,66.48 104.6,67 103.14,67 | 105.14,52.39 105.14,54.61 | 105.14,64.52 112,64.52 | 62.34,100.61 62.98,99.95 62.98,98.3 C8.1 | 55.1,82.8 52.82,82.8 | 56.88,83.06 60.94,83.06 X6.1 | 63.9,96.82 63.9,84.38 63.88,83.02 X6.1 | 70.86,70.13 67.8,70.13 | 62.81,59.69 61.71,59.69 | IC2.13 67.2,59.69 62.81,59.69 | 62.8,68.86 61.5,68.86 | 62.81,59.69 62.8,68.86 | 74,67.36 74,62 68.5,62 IC2.12 | 62.8,68.86 62.8,81.25 61.39,81.26 61.39,81.67 X6.1
  Top 0.813: 32.15,79.23 32.45,78.03 | 92.64,123.95 92.64,121.11 | 71.7,104.23 71.7,120.61 70.42,121.97 J3.3 | X7.1 83.13,129.02 84.3,128 92.64,128 92.63,125.43 | 71.6,104.2 66.5,104.2 66.5,90.92 67.51,89.92 70.72,89.95 71.73,88.95 71.69,83.06 70.69,82.06 69.33,82.06
  Top 1.016: 85.7,67.34 85.7,62.09 | 85.7,62.09 85.7,60.07 86.97,58.8 89.82,58.8 94.37,54.26 94.39,53.22 X4.1 97.71,52.39 105.14,52.39 105.14,39.14 110.73,35.05 | 67.8,70.46 67.8,81.79 | C2.- 74.03,69.53 74,67.36 87.11,67.36
  Bottom 0.406: J4.S1 126.73,46.99 126.73,51.44 126.09,52.07 124.95,52.07 J4.4
  Bottom 0.61: 23.27,79.05 22.47,78.36 J5.1 | BAT2.P$2 21.4,49.25 23.1,50.8 43.51,50.8 49.77,44.55 JP1.1
  Bottom 0.813: 23.27,79.05 24.2,79.84 24.59,79.84 24.6,79.83 26.8,79.83 27.36,79.27 28.12,79.27 v32.13,79.27 | J3.3 70.6,122.68 75.19,127.37 80.99,127.37 X7.1
  other vias: 30.77,79.27
  pour Bottom (isolate 0.5, hatched): 1.27,38.1 12.7,38.1 12.7,135.89 133.35,135.89 133.35,2.54 1.27,2.54
GPSPWR  (via drill 0.61)
  Top 0.305: v87.11,107.95 85.26,109.47 85.26,116.13 88.12,116.13 IC14.8 | v92.44,102.62 93.2,101.85 IC16.4 | v46.95,89.78 46.95,90.98 47.02,91.05 48.4,92.42 IC4.14
  Bottom 0.305: v92.44,102.62 v87.11,107.95 69.12,89.7 67.66,88.24 50.59,88.24 49.14,89.75 47.28,89.75 v46.95,89.78
K0  (via drill 0.61)
  Top 0.305: v50.78,108.46 51.8,107.44 51.8,106.93 51.55,106.68 51.55,106.17 IC4.38 | v34.27,107.19 25.13,98.04 J1.14
  Bottom 0.305: v50.78,108.46 49.51,107.19 v34.27,107.19
K1  (via drill 0.61)
  Top 0.305: v50.78,107.19 50.78,106.17 IC4.39 | v30.72,106.17 25.13,100.58 J1.12
  Bottom 0.305: v50.78,107.19 49.77,106.17 v30.72,106.17
KL1  (via drill 0.61)
  Top 0.305: v54.85,95.5 54.85,98.04 55.86,99.06 IC4.27 | v15.22,84.58 14.46,83.82 14.46,34.54 11.92,32 RN1.2
  Bottom 0.305: v54.85,95.5 53.45,94.25 49.13,94.25 | 32.25,94.25 31.5,95 30.75,95 25.63,95 25.38,94.73 v15.22,84.58 | 32.25,94.25 | 32.25,94.25 49.13,94.25 | 49.13,94.25 49.26,94.25 | J2.1 21.32,29.21 19.29,31.24 12.18,31.24 RN1.2
KL2  (via drill 0.61)
  Top 0.305: v29.45,33.27 45.95,46.58 45.95,94.88 47.48,96.27 47.48,103.12 47.23,103.38 46.21,103.38 45.96,103.12 45.83,103 IC4.2
  Bottom 0.305: v29.45,33.27 25.38,29.21 25.13,29.21 J2.2
KL3  (via drill 0.61)
  Top 0.305: v58.49,98.86 57.64,98.3 57.13,98.3 IC4.26 | v16.24,86.87 16.24,33.78 11.92,29.46 RN1.3
  Bottom 0.305: v58.49,98.86 57.03,97.89 35.37,97.89 34.46,98.8 28.17,98.8 v16.24,86.87 | J2.3 21.32,26.67 19.29,28.7 12.18,28.7 RN1.3
KL4  (via drill 0.61)
  Top 0.305: v18.78,30.23 18.78,113.67 19.41,114.3 31.05,114.3 42.99,102.26 44.43,102.26 IC4.3
  Bottom 0.305: v18.78,30.23 21.32,27.69 22.84,27.69 23.86,26.67 J2.4
KL5  (via drill 0.61)
  Top 0.305: v59.08,97.46 57.88,97.41 IC4.25 | v30.21,97.28 28,95 28,91.57 26.4,89.77 26.4,24.13 24.88,22.61 22.59,22.61 22.34,22.86 22.34,23.37 J2.5
  Bottom 0.305: v59.08,97.46 57.9,97.28 v30.21,97.28 | RN1.4 12.18,26.16 14.21,24.13 21.32,24.13 J2.5
KL6
  Top 0.305: IC4.4 44.43,101.5 42.49,101.5 35.83,108.2 32.37,108.2 31.73,107.57 31.73,105.92 24.88,99.06 23.99,99.06 23.35,98.42 23.35,95.29 26.09,92.85 26.09,90.76 24.19,88.56 21.13,88.56 20.81,88.25 20.81,80.77 23.35,78.23 23.35,25.15 24.11,24.38 J2.6
KL7
  Top 0.305: IC4.5 44.43,100.58 42.35,100.57 41.84,101.09 41.75,101.18 40.98,101.95 39.5,103.37 31.81,103.38 31.1,102.76 31.1,92.32 28.08,88.7 28.08,28.7 28.09,28.4 28.09,23.48 24.88,20.07 22.59,20.07 22.34,20.32 22.34,20.83 J2.7
KL8  (via drill 0.61)
  Top 0.305: v57.88,91.88 57.88,96.52 57.13,96.52 IC4.24 | v29,92.71 29,91.45 27.21,89.41 27.21,24 25.05,21.84 J2.8
  Bottom 0.305: v57.88,91.88 55.9,91.88 55.38,92.26 54.82,92.72 42.2,92.72 41.27,92.71 v29,92.71 | RN1.5 12.18,23.62 13.19,22.61 22.84,22.61 23.86,21.59 J2.8
KL9  (via drill 0.61)
  Top 0.305: v55.89,93.5 55.89,95.76 IC4.23
  Bottom 0.305: v55.89,93.5 31.75,93.5 31,94.25 25.91,94.25 25.64,93.98 14.46,82.55 14.46,38.34 13.46,37.34 12.18,37.34 9.13,34.29 9.18,21.89 10.09,21.32 RN1.6 19.08,21.33 19.29,21.08 21.32,19.05 J2.9
KL10  (via drill 0.61)
  Top 0.305: IC4.15 49.26,93.47 49.27,91.82 48.65,91.2 v48.65,88.42 46.77,86.65 46.77,36.65 25.13,18.9 J2.10 | v66.53,85.34 67.8,85.34 C1.2
  Bottom 0.305: RN1.7 12.18,18.54 13.19,17.53 22.84,17.53 23.86,18.54 J2.10 | v48.65,88.42 51.32,85.85 60.94,85.85 X6.2 61.76,85.34 v66.53,85.34
MCLR4620  (via drill 0.61)
  Top 0.305: v49.16,86.35 49.77,86.85 49.77,91.19 51.55,92.96 51.55,93.47 IC4.18 | R7.2 81.26,76.96 81.26,79.5 JP2.1
  Bottom 0.305: v49.16,86.35 53.62,81.79 81.01,81.79 JP2.1
N$1
  Top 0.813: D4.C 72.63,19.3 72.63,21.34 D2.A 72.71,22.81 69.66,22.84 69.36,23.35 68.87,24.24 59.12,24.23 X2.4 57.9,23.37 57.9,22.1 X2.3
N$2
  Top 0.813: D1.A 66.79,21.59 66.79,19.3 D3.C 65.77,18.8 59.17,18.8 X2.2 57.9,18.29 57.9,17.02 X2.1
N$3
  Top 0.813: R16.2 79.25,39.4 83.63,39.4 Q3.3 83.62,39.42 83.62,37.85 76.8,37.85 76.8,17.85 79.45,15.24 83.55,15.24 IC9.1
  Bottom 0.813: IC9.1 85.07,12.95 89.14,8.89 96.5,8.89 R15.2
N$4
  Top 0.813: R15.1 87.11,9.4 87.11,12.7 IC9.2
N$5
  Top 0.813: D1.C 67.29,26.42 71.61,26.42 D2.C 74.86,26.18 74.86,25.91 74.92,25.85 | D5.A 98.28,14.22 90.15,14.22 IC9.3 | IC10.IN 78.28,11.15 78.28,11.42 75.33,14.38 75.33,14.4 74.92,14.8 74.92,25.85 | 74.92,25.85 74.92,26.18
  Bottom 0.813: IC10.IN 78.72,8.64 78.72,15.66 79.72,16.66 89.41,16.66 89.43,15.24 IC9.3
N$6  (via drill 0.61)
  Top 0.813: D3.A 67.55,14.48 71.61,14.48 D4.A 73.39,13.72 75.93,11.18 75.93,7.37 IC10.GND 76.44,6.35 76.44,4.83 77.71,3.56 78.85,3.56 81.81,6.65 C23.- 84.06,6.6 104.63,6.6 R18.1 106.41,6.35 109.2,6.35 C24.1 110.98,6.35 112.51,6.35 | v101.84,25.91 100.82,25.91 R23.2 | Q5.2 109.2,32.51 109.2,29.72 111.24,27.69 R22.2 112.76,25.91 116.32,22.35 116.32,7.62 115.55,6.86 R19.2 113.78,6.35 112.51,6.35 | IC11.1 111.24,17.78 112.51,16.51 112.51,6.35
  Bottom 0.813: v101.84,25.91 108.44,32.51 Q5.2
N$7  (via drill 0.61)
  Top 0.406: R17.2 90.15,4.06 84.06,4.06 C23.+ 82.28,3.05 v81.26,3.05 | IC11.6 108.44,14.73 106.92,16.51 86.22,16.51 85.58,15.87 85.58,12.7 78.72,5.84 IC10.OUT
  Bottom 0.406: v81.26,3.05 78.98,5.33 78.72,5.33 IC10.OUT
N$8
  Top 0.406: R17.1 94.47,3.94 115.64,3.95 119.63,7.95 119.63,19.05 123.94,22.35 X3.2
N$9  (via drill 0.61)
  Top 0.305: R16.1 80.8,43.98 81.71,43.98 82.58,43.99 82.93,44.01 Q3.1 | v111.24,15.49 111.24,14.73 IC11.8
  Bottom 0.305: X3.1 123.68,20.07 115.81,20.07 v111.24,15.49 110.98,15.75 109.2,15.75 97.35,27.6 97.35,35.99 92.62,41.69 90.75,44 86.08,44 Q3.1
N$10  (via drill 0.61)
  Top 0.635: C2.+ 70.34,67.31 69.91,67.57 IC1.2 65.68,67.59 65.26,68.07 65,68.33 65,68.4 64.8,68.6 64.8,81.3 65.2,81.7 65.25,81.7 v65.25,110.74
  Bottom 0.635: v65.25,110.74 63.78,111.93 62.98,111.92 62.98,111.91 54.99,111.91 54,112.71 49.99,112.71 49.46,113.2 25.13,113.2 J1.2
N$11  (via drill 0.61)
  Top 0.254: v57.39,64.01 57.39,64.77 57.13,65.02 R2.1 | v71.87,60.44 73.39,58.93 IC2.8
  Bottom 0.254: v57.39,64.01 60.95,60.44 v71.87,60.44
N$12  (via drill 0.61)
  Top 0.305: IC1.5 59.65,70.23 58.26,70.23 57.13,69.09 R2.2 55.36,67.82 54.85,67.31 v54.85,62.48 | v55.61,46.74 56.63,46.74 IC6.1 | IC7.5 51.28,37.34 51.29,38.1 51.29,42.42 53.07,44.2 53.07,45.47 52.05,46.48 JP1.2
  Bottom 0.305: v55.61,46.74 55.36,46.99 54.85,46.99 | 54.85,46.99 52.56,46.99 JP1.2 | 54.85,46.99 v54.85,62.48
N$13  (via drill 0.61)
  Top 0.305: v54.8,89.32 IC4.22 | v51.26,89.3 50.4,88.52 50.4,85.96 47.69,83.28 47.69,28.55 48.5,27.94 69.73,27.94 | 69.73,27.94 69.73,34.04 70.34,34.54 IC8.6 | 69.73,27.94 74.68,27.94 74.68,28.13 74.69,28.19 74.67,28.3 74.67,29.49 C19.1
  Bottom 0.305: v54.8,89.32 53.28,89.3 v51.26,89.3
N$14
  Top 0.305: IC4.31 57.13,102.21 61.34,102.21 62.34,103.21 62.34,105.89 63.01,106.53 Q1.1 63.99,107.57 63.99,111.12 64.63,111.76 66.02,111.76 68.31,109.47 C7.1
N$15
  Top 0.305: C24.2 109.97,9.65 109.97,12.7 IC11.7
N$16
  Top 0.305: R18.2 106.41,9.65 107.17,10.41 107.17,12.7 IC11.5
N$17
  Top 0.305: IC13.1 35.8,62.74 34.86,62.74 34.4,63.04 33.13,63.03 32.9,63.03 32.41,63.03 31.86,62.53 Q2.2
N$18
  Top 0.305: IC13.2 37.29,60.99 37.29,60.18 36.97,59.86 34.15,59.86 33.83,60.18 33.83,61.14 Q2.1
N$19
  Top 0.254: IC4.43 47.74,106.17 47.74,108.97 69.33,130.56 71.87,130.56 72.37,131.06 79.74,131.06 X7.2
N$20  (via drill 0.61)
  Top 0.305: IC4.30 57.16,101.4 62.93,101.4 63.13,101.68 Q1.2 | v67.99,99.68 68.41,99.68 C9.1
  Bottom 0.305: v67.99,99.68 65.77,101.85 63.99,101.85 Q1.2
N$21
  Top 0.305: R8.2 84.31,76.96 84.31,79.5 JP2.2 83.1,82.04 83.1,111.3 71.07,125.02 J3.1
N$22
  Top 0.305: R19.1 113.78,9.65 113.82,9.56 113.82,21.49 112.76,22.1 R20.2 112.04,21.25 111.64,20.96 110.17,20.96 109.92,20.75 IC11.2
N$23
  Top 0.305: IC5.9 102.3,65.79 97.33,65.79 97.01,66.11 97.01,66.55 Q4.2 91.22,67.03 91.14,67.06 C12.2
N$24
  Top 0.305: IC5.10 102.35,64.51 97.33,64.51 97.01,64.19 97.01,62.74 Q4.1 96,62.18 91.68,62.18 C11.2
N$25
  Top 0.305: IC5.14 102.85,59.18 102.85,56.13 C14.2
N$26
  Top 0.305: IC5.1 102.35,75.95 88.12,75.95 R9.2 86.85,76.96 86.85,79.5 JP2.3
N$27  (via drill 0.61)
  Top 0.305: D5.C 100.06,19.05 100.06,21.84 R23.1 100.82,23.11 102.85,25.15 v102.85,29.46
  Bottom 0.305: v102.85,29.46 105.9,32.51 Q5.1
N$28
  Top 0.305: R4.1 62.21,52.32 65.77,52.32 IC2.1 66.02,52.07 67.04,52.07 IC2.2 67.04,51.05 67.04,44.4 X1.3
N$30
  Top 0.305: IC5.23 113.01,69.6 116.06,69.6 R10.1
N$31
  Top 0.305: R10.2 120.13,69.6 122.92,69.6 R11.2 123.68,68.58 123.68,66.55 C16.1 122.92,64.77 122.92,53.34 J4.1
N$32
  Top 0.305: IC5.15 113.01,59.18 121.9,50.29 J4.2
N$33
  Top 0.305: IC5.16 113.01,60.45 122.16,51.41 123.87,51.41 124.19,51.09 124.19,50.8 J4.3
N$34
  Top 0.305: IC5.17 111.26,61.95 110.94,61.64 110.94,61.21 110.94,53.23 121.9,42.42 R12.2
N$35
  Top 0.305: R12.1 125.46,40.64 125.46,36.58 X8.2
N$37  (via drill 0.61)
  Top 0.305: v39.2,101.19 39.83,100.61 39.83,98.04 39.84,97.76 40.15,97.44 43.17,97.44 43.49,97.75 43.49,98.22 44.49,98.22 IC4.8 | v26.15,106.68 25.64,107.19 25.64,109.22 24.88,109.98 J1.4
  Bottom 0.305: v39.2,101.19 35.79,104.45 28.43,104.45 v26.15,106.68
N$38
  Top 0.305: IC4.20 53.32,93.47 53.32,89.32 52.31,88.31 52.31,86.11 C6.1 52.82,85.6 55.1,85.6 R6.2 56.37,86.11 56.37,85.97 56,85.6 51.36,85.6 50.55,84.79 49.6,83.84 49.6,69.4 50.89,68.11 R5.2
N$39  (via drill 0.61)
  Top 0.305: v46.57,102.36 46.57,97.67 46.31,97.41 45.7,97.41 IC4.9
  Bottom 0.305: v46.57,102.36 43.67,105.16 28.94,105.16 26.4,107.7 25.13,107.7 J1.6
N$40
  Top 0.305: R20.1 108.7,22.1 108.7,19.81 IC11.3
N$41
  Top 0.305: R21.2 104.3,19.79 104.29,19.11 104.29,18 104.93,17.38 107.36,17.38 IC11.4 107.53,19.81 107.53,24.79 108.44,25.91 R22.1
N$42
  Top 0.813: Q3.2 85.87,41.76 85.88,44.48 85.88,46.23 X5.1 87.6,50.19 94.44,50.21 X4.2 96.85,49.04 98.93,47.89 98.96,46.65 98.96,35.88 99.3,35.54 106.48,30.19 106.46,30.18 106.46,23.88 106.46,23.4 R21.1
N$43
  Top 0.305: IC2.10 71.1,58.17 72.12,58.17 IC2.9 72.37,57.15 76.69,52.83 76.69,52.58 R3.2 77.71,52.58 77.71,55.37 R1.1
N$44  (via drill 0.61)
  Top 0.305: v95.74,112.52 95.74,112.78 95.72,112.88 IC14.2 | v106.74,106.43 105.13,105.26 X10.8
  Bottom 0.305: v95.74,112.52 101.84,106.43 v106.74,106.43
N$45
  Top 0.305: 101.4,101.43 101.41,102.06 101.41,103.3 100.82,103.89 X10.9 | IC16.2 96.61,100.69
  Top 0.54: 96.61,100.69 100.67,100.69 101.08,101.09 101.4,101.43
N$46  (via drill 0.61)
  Top 0.305: v96.76,106.93 96.76,113.28 96.5,113.54 94.47,113.54 IC14.3 | v102.84,100.85 101.99,101.73 101.99,105.36 100.82,106.43 X10.5
  Bottom 0.305: v102.84,100.85 v96.76,106.93
N$47
  Top 0.305: IC14.1 93.71,112.27 89.64,107.63 88.63,106.5 C27.1 88.88,104.9 88.88,102.87 IC15.1
N$48  (via drill 0.61)
  Top 0.305: IC14.4 96.38,114.17 96.89,114.68 v97.01,114.68 | v101.08,114.68 103.62,112.14 108,107.89 108,104.64 107.36,104 103.62,104 | 103.62,104 103.36,104.01 | X10.10 103.62,104.14 103.62,104
  Bottom 0.305: v101.08,114.68 v97.01,114.68
N$50
  Top 0.305: 41.39,53.16 41.39,49.53 BAT2.P$1 | 41.39,53.16 41.39,56.13 C25.1 | 41.39,53.16 37.24,53.16 36.92,53.48 36.92,58.48 37.24,58.8 38.26,58.8 38.57,59.11 IC13.3
PGC  (via drill 0.61)
  Top 0.305: v110.73,96.27 110.73,74.95 111.05,74.63 112,74.63 IC5.27 | v50.27,100.08 50.27,95.3 50,95.04 IC4.16
  Bottom 0.305: 96.76,110.24 87.36,119.63 70.6,119.63 J3.5 | 96.76,110.24 v110.73,96.27 | v50.27,100.08 56.12,105.92 83.8,105.92 88.12,110.24 96.76,110.24
PGD  (via drill 0.61)
  Top 0.305: 68.56,123.78 68.56,122.43 67.8,121.67 J3.4 | 68.56,123.78 68.56,125.22 72.37,129.03 73.62,130.2 93.55,130.2 94.55,129.2 94.55,124.28 111.74,107.19 111.74,76.45 112,76.2 IC5.28 | v51.29,96.27 51.29,95.25 50.78,94.74 IC4.17 | v70.51,96.52 73.06,98.32 72.96,121.02 70.41,123.78 68.56,123.78
  Bottom 0.305: v51.29,96.27 51.55,96.52 v70.51,96.52
RX  (via drill 0.61)
  Top 0.305: v88.12,111.25 87.26,111.76 87.26,112.88 88.12,112.88 IC14.13 | v45.7,105.16 45.7,103.89 IC4.1
  Bottom 0.305: v88.12,111.25 85.07,108.2 53.07,108.2 50.02,105.16 v45.7,105.16
SCL  (via drill 0.61)
  Top 0.305: IC13.6 38.77,69.11 38.77,71.63 R13.2 38.59,73.41 36.81,75.18 v36.83,76.23 | v52.61,95.6 52.6,104.1 52.31,104.39 52.31,104.9 IC4.37 | v33.71,95.25 33.7,94.95 IC12.6 33.71,80.75 v33.6,79.94
  Bottom 0.305: v52.61,95.6 52.05,95.25 v33.71,95.25 | J5.4 25.13,75.69 25.98,76.4 32.97,76.4 33.6,77.03 v33.6,79.94 36.01,79.94 36.33,79.62 36.33,76.74 v36.83,76.23
SD  (via drill 0.61)
  Top 0.305: IC6.4 60.18,44.73 61.74,44.73 63.22,42.4 66.29,42.4 67.65,42.42 68.25,42.83 68.28,42.92 68.31,43.11 68.31,51.05 IC2.3 68.31,52.83 v66.39,54.95 | v43.42,76.71 43.42,95.94 44.05,96.57 44.43,96.57 IC4.10
  Bottom 0.305: v43.42,76.71 43.42,75.88 64.4,54.95 65.58,54.95 v66.39,54.95
SDA  (via drill 0.61)
  Top 0.305: R14.1 25.64,85.85 25.64,74.17 24.88,73.41 J5.6 | v39.86,69.85 39.86,69.09 IC13.5 | v48.5,96.27 48.5,104.9 IC4.42 | v36.63,96.28 34.99,94.18 34.99,82.8 IC12.5 34.98,80.75 34.98,79.86 v34.97,78.66
  Bottom 0.305: v39.86,69.85 37.07,72.64 34.97,72.64 | 34.97,72.64 25.13,72.64 J5.6 | v36.63,96.28 v48.5,96.27 | 34.97,72.64 v34.97,78.66
SHDN  (via drill 0.61)
  Top 0.305: v44.43,78.72 44.43,95.76 IC4.11 | v75.93,60.45 76.69,59.69 R1.2
  Bottom 0.305: v75.93,60.45 74.25,62.13 62.41,62.13 45.82,78.72 v44.43,78.72
TX  (via drill 0.61)
  Top 0.305: v88.13,117.59 89.54,116.33 89.54,113.54 88.88,113.54 IC14.12 | v51.8,114.3 46.82,109.47 46.82,106.17 IC4.44
  Bottom 0.305: v88.13,117.59 83.95,113.76 52.31,113.79 v51.8,114.3
VCC  (via drill 0.61)
  Top 0.305: 89.14,112.22 88.88,112.22 IC14.14 | 86.58,114.18 IC14.11
  Top 0.406: C22.+ 90.15,119.43 90.15,112.22 89.14,112.22 89.14,109.9 | C21.1 89.65,123.95 89.65,121.16 C22.+ | v86.36,121.24 88.38,121.21 88.43,121.11 C22.+ | R7.1 81.52,73.66 83.3,73.66 R8.1 | R9.1 86.32,73.53 85.05,73.53 R8.1 | C15.2 119.46,66.55 119.44,67.27 119.12,67.58 115.5,67.56 114.82,67.55 114.5,67.24 114.5,66.06 114.18,65.74 113.01,65.74 IC5.20 112,65.74 110.45,65.74 110.45,65.75 | IC16.1 95.74,99.82 94.22,99.82 IC16.6 93.2,99.75 | IC15.6 88.73,99.31 | 88.73,97.03 C28.1 89.14,95.5 89.14,95.25 | IC15.6 88.73,100.33 87.76,101.09 87.77,101.85 IC15.2 87.76,103.02 87.33,103.57 87.33,106.35 89.13,108.38 89.14,109.9 | IC15.6 88.88,99.75 | R8.1 85.46,73.53 85.47,74.67 85.46,84.81 92.94,91.44 92.96,91.44 v92.93,91.47 | 59.56,99.81 57.14,99.81 IC4.28 | 60.94,97.63 60.54,97.43 60.55,97.43 61.08,97.56 60.78,97.53 60.18,96.77 C8.2 | C3.2 34.88,98.81 | C26.2 38,81.03 38,98.32 v37.37,98.8 | R14.2 22.84,85.85 24.11,84.58 24.11,78.49 J5.2 | IC8.2 66.28,35.81 66.28,35.05 IC8.3 65.21,34.8 61.96,34.8 C18.+ | IC7.2 56.88,34.8 | v29.45,46.74 30.65,46 42.88,45.99 44.16,47.26 44.16,62.03 44.12,62.79 C20.1 | v29.45,46.74 | v29.45,46.74 29.45,45.43 | 29.45,45.43 29.45,44.4 | 29.45,70.2 36.04,70.22 IC13.8 36.04,69.15 36.05,71.67 R13.1 | 29.45,84.24 29.46,84.33 v29.45,84.22 v29.45,77.95 | 31.19,84.24 IC12.8 31.19,84.24 | v58.91,103.89 58.91,107.44 63.99,112.52 63.99,120.14 67.04,123.19 J3.2 | 86.58,114.18 86.55,114.15 86.55,109.9 89.14,109.9 | v29.45,45.3 29.46,45.47 29.45,45.43 | v30.81,84.25 30.99,84.33 30.99,84.24 | v32.18,84.24 32.26,84.33 32.16,84.24 | v36.21,98.8 36.32,98.81 36.32,98.8 | v94.01,90.39 94.23,90.42 94.14,90.32
  Top 0.406: v91.85,92.52 91.95,92.71 91.81,92.58
  Top 0.5: 59.56,99.81 60.18,99.19 60.18,98.3 C8.2 | v41.22,98.81 41.22,99.01 IC4.7 | v54.85,99.81 55.86,99.81 IC4.28
  Top 0.54: 88.73,99.31 88.73,97.03 | 88.88,99.75 93.2,99.75
  Top 0.61: 56.88,34.8 59.93,34.8 C18.+ | 60.8,34.77 IC7.2
  Top 0.813: 34.88,98.81 36.32,98.8 v37.37,98.8
  Top 1.016: 110.45,65.75 107.94,65.75 107.94,77.15 102.85,81.35 100.17,81.35 95.28,86.4 95.28,89.26 94.14,90.32 92.94,91.44 91.81,92.58 89.14,95.25 | 29.45,44.4 29.45,70.2 v29.45,84.22 29.45,84.24 | 29.45,84.24 30.99,84.24 31.19,84.24 | v60.78,38.8 60.8,34.77 | 31.19,84.24 32.16,84.24 32.16,97.4 34.41,97.4 C3.2
  Bottom 0.406: v86.36,121.24 69.16,121.23 68.28,122.55 68.25,123.74 J3.2 | 36.17,98.81 37.29,98.68 | 41.21,98.81 v41.22,98.81 41.23,99.01 | RN1.1 12.18,34.29 24.62,46.74 v29.45,46.74 29.45,47.74 | 29.45,47.74 29.45,48.74 | 29.45,47.74 29.46,47.75 v29.44,48.2 | v58.03,38.8 58.17,38.86 58.17,38.8 | v59.43,38.8 59.44,38.86 v59.44,38.8
  Bottom 0.5: 41.23,99.01 54.09,99.01 v54.85,99.81 v58.91,103.89
  Bottom 0.61: v37.37,98.8 36.17,98.81 | 37.29,98.68 40.89,98.68 41.21,98.81 | v29.45,77.95 25.13,77.98 J5.2
  Bottom 1.016: 29.45,48.74 29.45,40.62 31.45,38.78 58.17,38.8 v59.44,38.8 v60.78,38.8 | v29.45,84.22 43.51,84.22 54,74 92,74 94,75.97 94.03,90.38 91.88,92.53 v91.85,92.53 94.03,90.38
(copper drawn outside any net)
  shapes: Top area x1, Top circle x24

### Text on the board
Top: SOUND | + | 4550 | 2550 | CTRL | + | SHDN | SW | BAT | Rled+ | + | + | + | + | 12v | Gled+ | + | + | + | DIP2007 | +